# EAGLE design Oscilloscope (EAGLE 9.0.1)
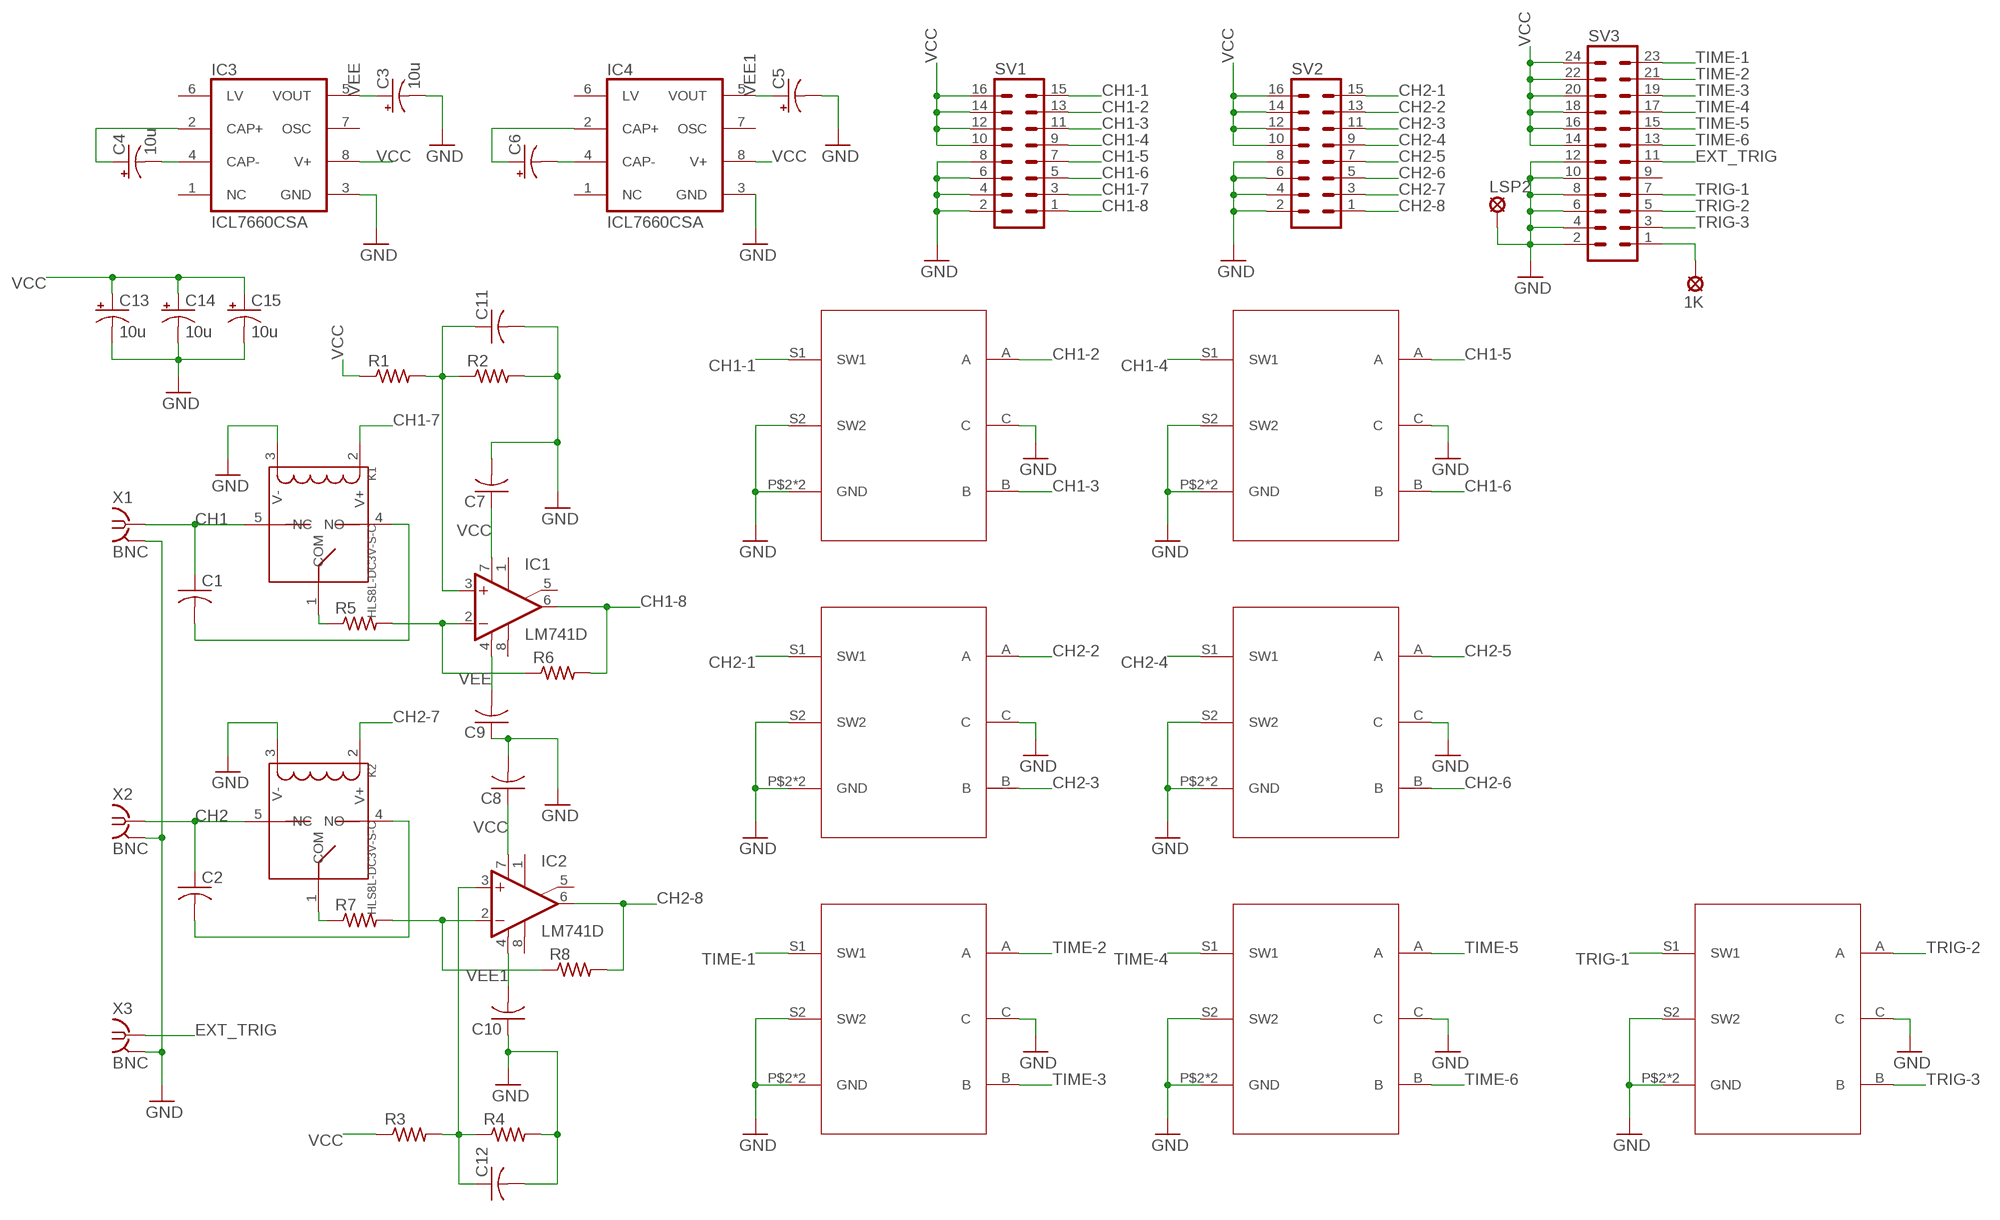
[diagram p0: schematic, sheet 1]

## Parts
1K  LSP11  [LSP11]
C1  C-USC0402K  [C0402K]
C2  C-USC0402  [C0402]
C3  10u  CPOL-USE2-5  [E2-5]
C4  10u  CPOL-USE2-5  [E2-5]
C5  CPOL-USE2-5  [E2-5]
C6  CPOL-USE2-5  [E2-5]
C7  C-USC0402  [C0402]
C8  C-USC0402  [C0402]
C9  C-USC0402  [C0402]
C10  C-USC0402  [C0402]
C11  C-USC0402  [C0402]
C12  C-USC0402K  [C0402K]
C13  10u  CPOL-USE2-5  [E2-5]
C14  10u  CPOL-USE2-5  [E2-5]
C15  10u  CPOL-USE2-5  [E2-5]
IC1  LM741D  [SO08]
IC2  LM741D  [SO08]
IC3  ICL7660CSA  [SO08]
IC4  ICL7660CSA  [SO08]
K1  HLS8L-DC3V-S-C  RELAY-HLS8L-DC3V-S-C(5P-19X15MM)  [REY5-19.0X15.0X15.0MM]
K2  HLS8L-DC3V-S-C  RELAY-HLS8L-DC3V-S-C(5P-19X15MM)  [REY5-19.0X15.0X15.0MM]
LSP2  LSP11  [LSP11]
R1  R-US_R0402  [R0402]
R2  R-US_R0402  [R0402]
R3  R-US_R0402  [R0402]
R4  R-US_R0402  [R0402]
R5  R-US_R0402  [R0402]
R6  R-US_R0402  [R0402]
R7  R-US_R0402  [R0402]
R8  R-US_R0402  [R0402]
SV1  MA08-2  [MA08-2]
SV2  MA08-2  [MA08-2]
SV3  MA12-2  [MA12-2]
U$2  EC11S  [EC11S]
U$3  EC11S  [EC11S]
U$4  EC11S  [EC11S]
U$5  EC11S  [EC11S]
U$6  EC11S  [EC11S]
U$7  EC11S  [EC11S]
U$8  EC11S  [EC11S]
X1  BNC  [BNC]
X2  BNC  [BNC]
X3  BNC  [BNC]

## Nets
CH1: C1.1 K1.5(NC) X1.P$1(SIG)
CH1-1: SV1.15 U$3.S1(SW1)
CH1-2: SV1.13 U$3.A
CH1-3: SV1.11 U$3.B
CH1-4: SV1.9 U$4.S1(SW1)
CH1-5: SV1.7 U$4.A
CH1-6: SV1.5 U$4.B
CH1-7: K1.2(V+) SV1.3
CH1-8: IC1.6(OUT) R6.2 SV1.1
CH2: C2.1 K2.5(NC) X2.P$1(SIG)
CH2-1: SV2.15 U$2.S1(SW1)
CH2-2: SV2.13 U$2.A
CH2-3: SV2.11 U$2.B
CH2-4: SV2.9 U$5.S1(SW1)
CH2-5: SV2.7 U$5.A
CH2-6: SV2.5 U$5.B
CH2-7: K2.2(V+) SV2.3
CH2-8: IC2.6(OUT) R8.2 SV2.1
EXT_TRIG: SV3.11 X3.P$1(SIG)
GND: C3.- C5.- C7.2 C8.2 C9.1 C10.1 C11.2 C12.2 C13.- C14.- C15.- IC3.3(GND) IC4.3(GND) K1.3(V-) K2.3(V-) LSP2.MP R2.2 R4.2 SV1.2 SV1.4 SV1.6 SV1.8 SV2.2 SV2.4 SV2.6 SV2.8 SV3.2 SV3.4 SV3.6 SV3.8 SV3.10 SV3.12 U$2.C U$2.P$2(GND) U$2.P$3(GND) U$2.S2(SW2) U$3.C U$3.P$2(GND) U$3.P$3(GND) U$3.S2(SW2) U$4.C U$4.P$2(GND) U$4.P$3(GND) U$4.S2(SW2) U$5.C U$5.P$2(GND) U$5.P$3(GND) U$5.S2(SW2) U$6.C U$6.P$2(GND) U$6.P$3(GND) U$6.S2(SW2) U$7.C U$7.P$2(GND) U$7.P$3(GND) U$7.S2(SW2) U$8.C U$8.P$2(GND) U$8.P$3(GND) U$8.S2(SW2) X1.P$2(GND) X1.P$3(GND) X1.P$4(GND) X1.P$5(GND) X2.P$2(GND) X2.P$3(GND) X2.P$4(GND) X2.P$5(GND) X3.P$2(GND) X3.P$3(GND) X3.P$4(GND) X3.P$5(GND)
N$1: C1.2 K1.4(NO)
N$2: C2.2 K2.4(NO)
N$4: IC2.2(-IN) R7.2 R8.1
N$5: C4.- IC3.4(CAP-)
N$6: C4.+ IC3.2(CAP+)
N$7: C6.- IC4.4(CAP-)
N$8: C6.+ IC4.2(CAP+)
N$9: C11.1 IC1.3(+IN) R1.2 R2.1
N$10: C12.1 IC2.3(+IN) R3.2 R4.1
N$11: 1K.MP SV3.1
N$19: K1.1(COM) R5.1
N$20: IC1.2(-IN) R5.2 R6.1
N$21: K2.1(COM) R7.1
TIME-1: SV3.23 U$6.S1(SW1)
TIME-2: SV3.21 U$6.A
TIME-3: SV3.19 U$6.B
TIME-4: SV3.17 U$7.S1(SW1)
TIME-5: SV3.15 U$7.A
TIME-6: SV3.13 U$7.B
TRIG-1: SV3.7 U$8.S1(SW1)
TRIG-2: SV3.5 U$8.A
TRIG-3: SV3.3 U$8.B
VCC: C7.1 C8.1 C13.+ C14.+ C15.+ IC1.7(V+) IC2.7(V+) IC3.8(V+) IC4.8(V+) R1.1 R3.1 SV1.10 SV1.12 SV1.14 SV1.16 SV2.10 SV2.12 SV2.14 SV2.16 SV3.14 SV3.16 SV3.18 SV3.20 SV3.22 SV3.24
VEE: C3.+ C9.2 IC1.4(V-) IC3.5(VOUT)
VEE1: C5.+ C10.2 IC2.4(V-) IC4.5(VOUT)
Unconnected: IC1.1(ON1) IC1.5(ON2) IC1.8(OPT) IC2.1(ON1) IC2.5(ON2) IC2.8(OPT) IC3.1(NC) IC3.6(LV) IC3.7(OSC) IC4.1(NC) IC4.6(LV) IC4.7(OSC) SV3.9

## Library data of the parts
1K LSP2 = solpad:LSP11: SOLDER PAD drill 1.1 mm
C1 C2 C7-C12 = rcl:C-US: CAPACITOR, American symbol; SPICEPREFIX: C
C3-C6 C13-C15 = rcl:CPOL-US: POLARIZED CAPACITOR, American symbol; SPICEPREFIX: C
IC1 IC2 = linear:*741: OP AMP
IC3 IC4 = maxim:ICL7660CSA: VOLTAGE CONVERTER; MF: MAXIM; MPN: ICL7660CSA; OC_FARNELL: 9724710; OC_NEWARK: 34C3732
K1 K2 = Seeed-Relay:RELAY-HLS8L-DC3V-S-C(5P-19X15MM): 315030009; MPN: HLS8L-DC3V-S-C
R1-R8 = resistor:R-US_: RESISTOR, American symbol
SV1 SV2 = con-lstb:MA08-2: PIN HEADER; OC_FARNELL: unknown; OC_NEWARK: unknown
SV3 = con-lstb:MA12-2: PIN HEADER; OC_FARNELL: unknown; OC_NEWARK: unknown
U$2-U$8 = MAX6818:EC11S
X1-X3 = MAX6818:BNC

## Board
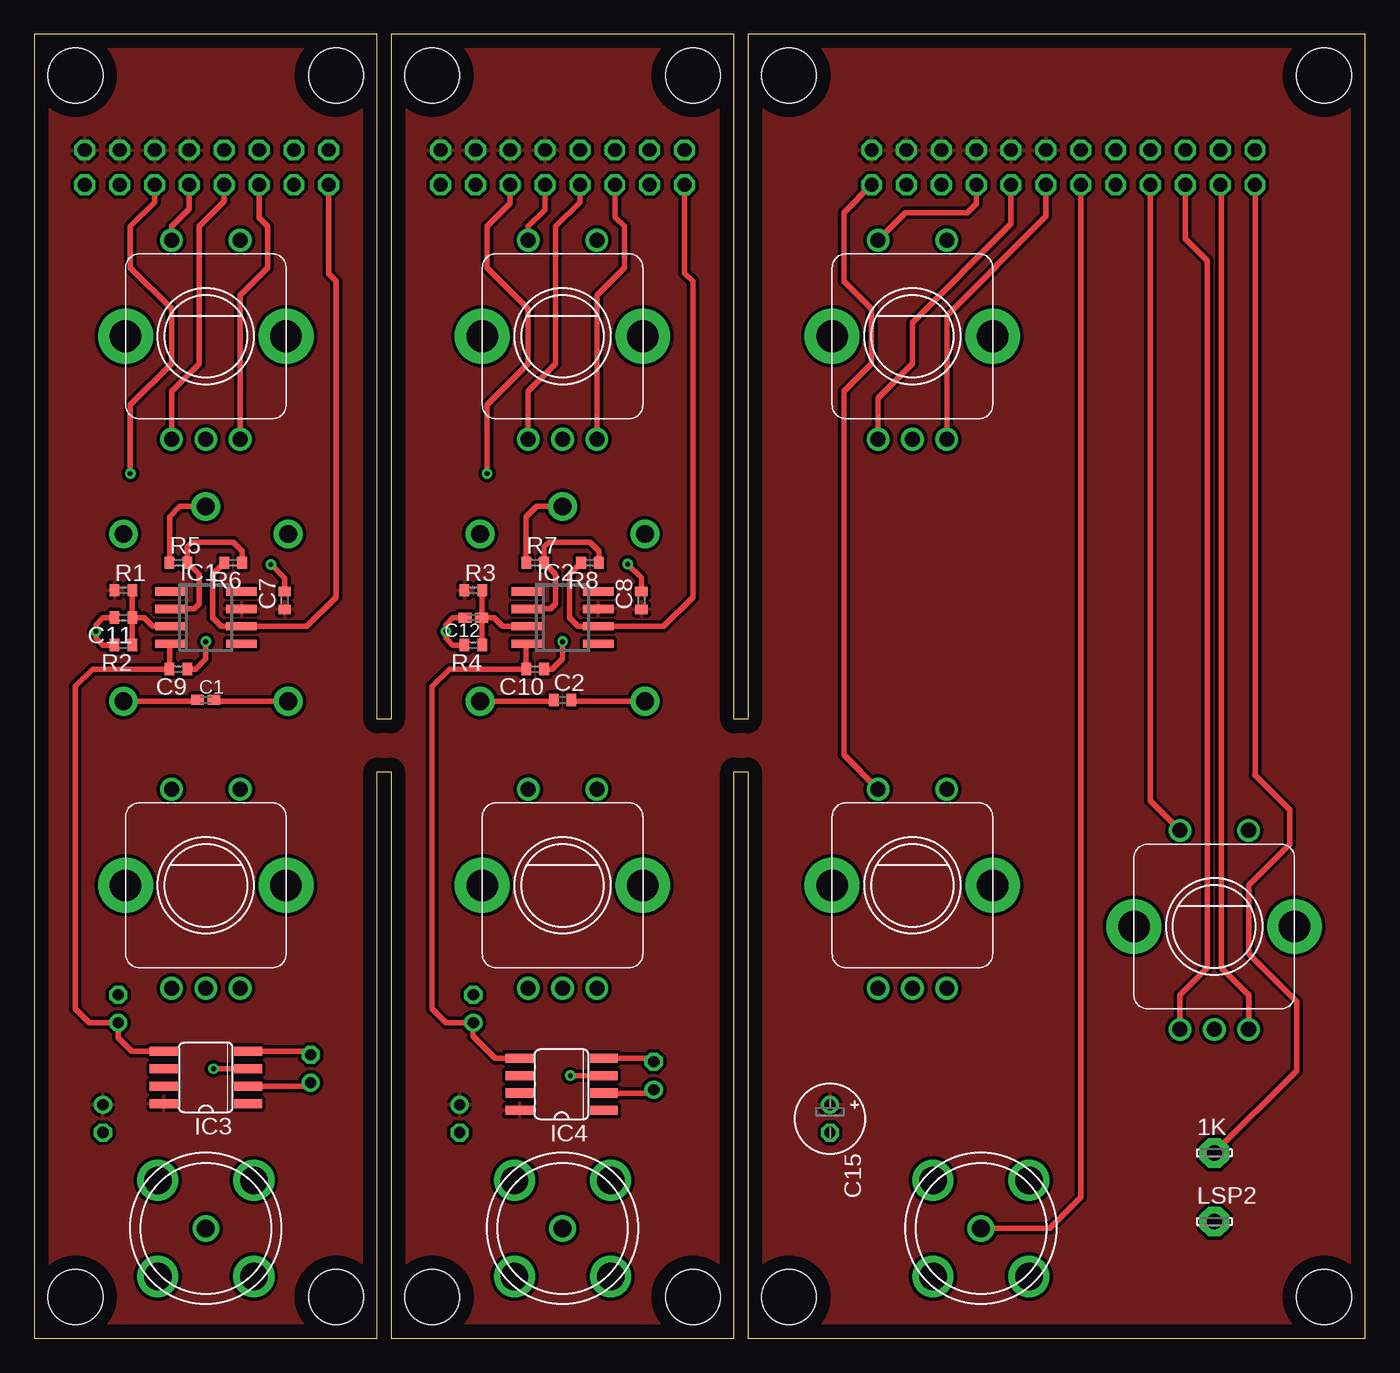
[diagram p1: board, top side]
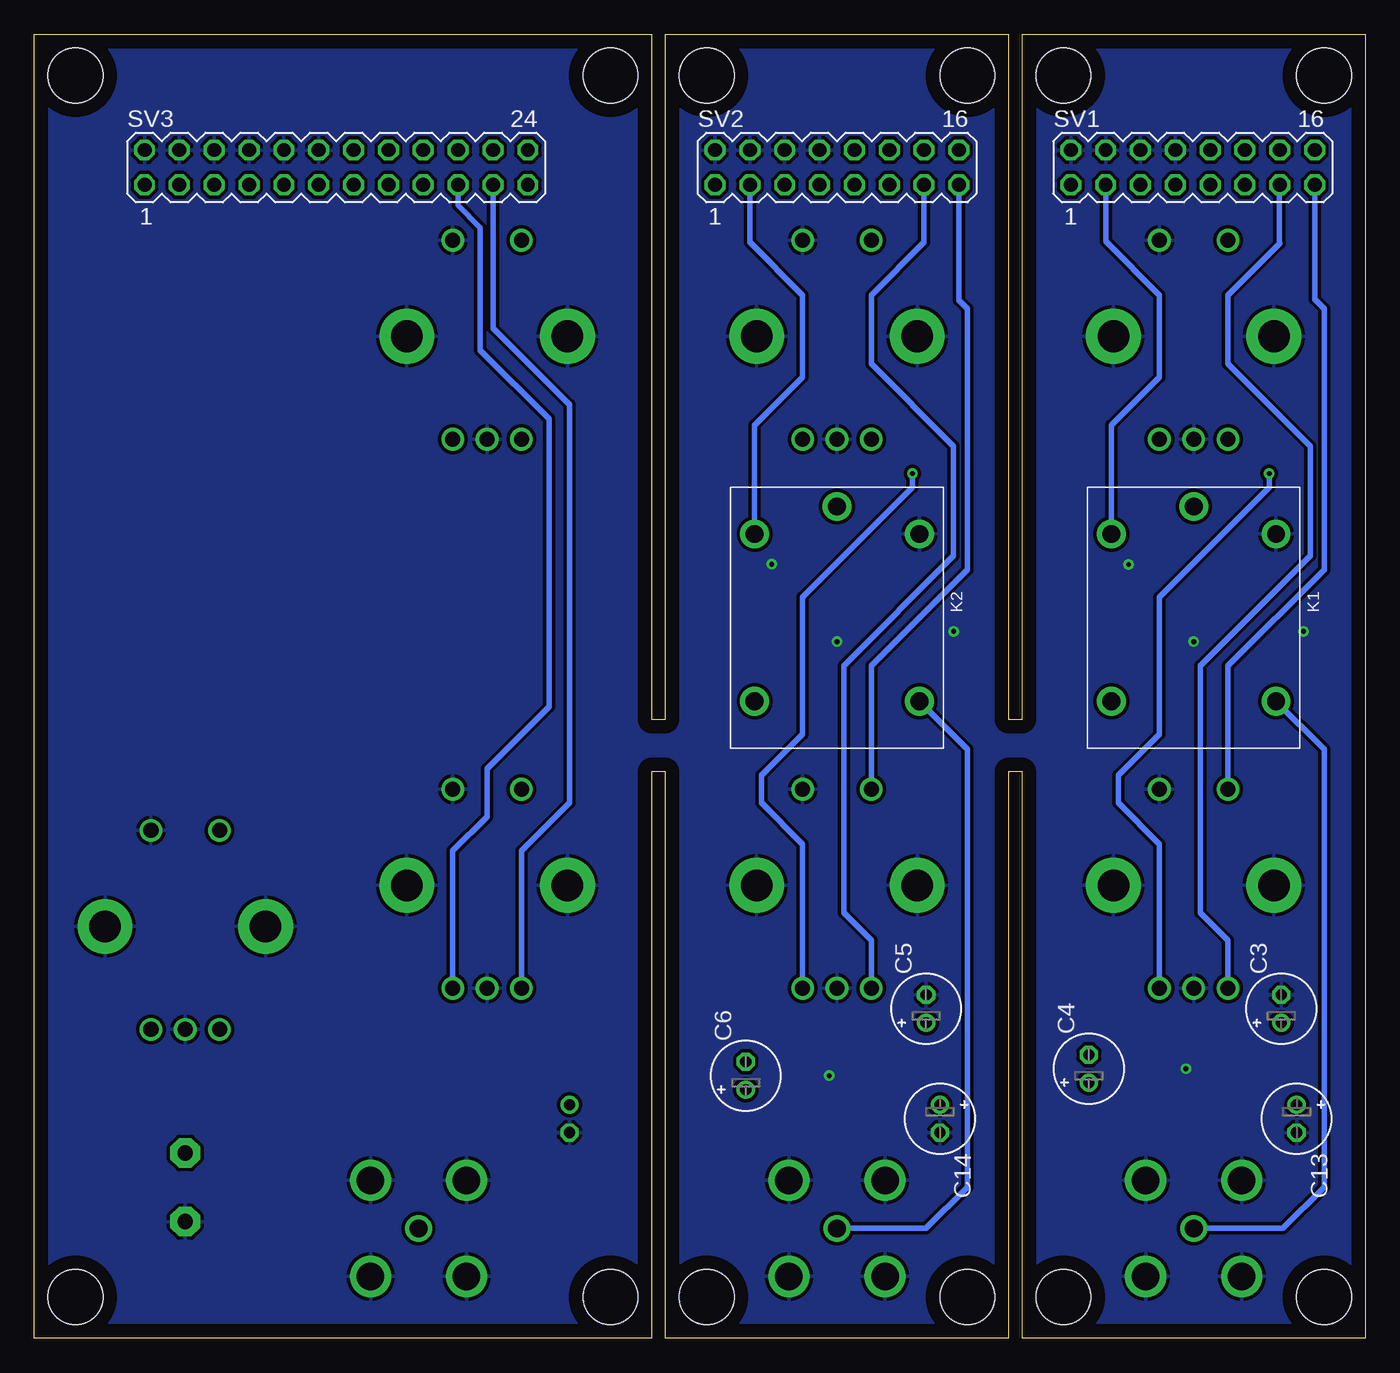
[diagram p2: board, bottom side, seen from below]

Size 97 x 95 mm. Coordinates in mm from the lower left corner, seen from the top.
Outline: 0,0 25,0 25,41.27 26,41.27 26,0 51,0 51,41.27 52,41.27 52,0 97,0 97,95 52,95 52,45.09 51,45.09 51,95 26,95 26,45.09 25,45.09 25,95 0,95 0,0
Copper layers (1*16): Top 0.035mm / dielectric 1.5mm / Bottom 0.035mm
Design rules "default": minimum track width 6mil, minimum drill 0.35mm, track to track 6mil, track to pad 6mil, pad to pad 6mil, via to via 6mil, smd to smd 6mil, copper to edge 40mil, drill to drill 6mil, minimum pad ring 10mil, minimum via ring 8mil, stop-mask expansion 4mil, vias tented up to drill 0mil, thermal gap 10mil
Holes 4 mm at 3,3 29,3 22,3 48,3 55,3 94,3 55,92 94,92 48,92 29,92 22,92 3,92

### Footprints (pad centres in the part's own frame; a part is rotated, then mirrored left to right if it is on the bottom)
LSP11 = drill 1.118 pad 2.159 octagon: MP 0,0
C0402K = smd 0.925 x 0.74: 1 -0.6,0; 2 0.6,0
C0402 = smd 0.7 x 0.9: 1 -0.65,0; 2 0.65,0
E2-5 = drill 0.813 pad 1.27: + -1.016,0 | drill 0.813 pad 1.27 octagon: - 1.016,0
SO08 = smd 0.6 x 2.2: 1 -1.905,-2.6; 2 -0.635,-2.6; 3 0.635,-2.6; 4 1.905,-2.6; 5 1.905,2.6; 6 0.635,2.6; 7 -0.635,2.6; 8 -1.905,2.6
SO08' = smd 0.66 x 2.032: 1 -1.905,-3.073; 2 -0.635,-3.073; 3 0.635,-3.073; 4 1.905,-3.073; 5 1.905,3.073; 6 0.635,3.073; 7 -0.635,3.073; 8 -1.905,3.073
REY5-19.0X15.0X15.0MM = drill 1.3 pad 2.1: 1 -8.1,0; 2 -6.1,-6; 3 -6.1,6; 4 6.1,-6; 5 6.1,6
R0402 = smd 0.7 x 0.9: 1 -0.65,0; 2 0.65,0
MA08-2 = drill 1.016 octagon: 1 -8.89,-1.27; 2 -8.89,1.27; 3 -6.35,-1.27; 4 -6.35,1.27; 5 -3.81,-1.27; 6 -3.81,1.27; 7 -1.27,-1.27; 8 -1.27,1.27; 9 1.27,-1.27; 10 1.27,1.27; 11 3.81,-1.27; 12 3.81,1.27; 13 6.35,-1.27; 14 6.35,1.27; 15 8.89,-1.27; 16 8.89,1.27
MA12-2 = drill 1.016 octagon: 1 -13.97,-1.27; 2 -13.97,1.27; 3 -11.43,-1.27; 4 -11.43,1.27; 5 -8.89,-1.27; 6 -8.89,1.27; 7 -6.35,-1.27; 8 -6.35,1.27; 9 -3.81,-1.27; 10 -3.81,1.27; 11 -1.27,-1.27; 12 -1.27,1.27; 13 1.27,-1.27; 14 1.27,1.27; 15 3.81,-1.27; 16 3.81,1.27; 17 6.35,-1.27; 18 6.35,1.27; 19 8.89,-1.27; 20 8.89,1.27; 21 11.43,-1.27; 22 11.43,1.27; 23 13.97,-1.27; 24 13.97,1.27
EC11S = drill 1.1: A -2.5,-7.5; B 2.5,-7.5; C 0,-7.5; S1 -2.5,7; S2 2.5,7 | drill 2.3 pad 4: P$2 -5.85,0; P$3 5.85,0
BNC = drill 1.3: P$1 0,0 | drill 2: P$2 3.5,3.5; P$3 -3.5,3.5; P$4 3.5,-3.5; P$5 -3.5,-3.5

### Placement (x,y rotation side)
1K  86,13.5 0 top
C1  12.5,46.51 0 top
C2  38.5,46.5 0 top
C3  6.12,24 90 bottom
C4  20.14,19.64 90 bottom
C5  32,24 90 bottom
C6  45.15,19.13 90 bottom
C7  18.25,53.75 90 top
C8  44.25,53.75 90 top
C9  10.5,48.75 180 top
C10  36.5,48.75 180 top
C11  6.5,52.5 180 top
C12  32,52.5 180 top
C13  5,16 270 bottom
C14  31,16 270 bottom
C15  58,16 270 top
IC1  12.5,52.5 270 top
IC2  38.5,52.5 270 top
IC3  ICL7660CSA  [SO08']  12.5,19 90 top
IC4  ICL7660CSA  [SO08']  38.43,18.5 90 top
K1  12.5,52.5 270 bottom
K2  38.5,52.5 270 bottom
LSP2  86,8.5 0 top
R1  6.5,54.5 0 top
R2  6.5,50.5 180 top
R3  32,54.5 0 top
R4  32,50.5 180 top
R5  10.5,56.5 0 top
R6  14.5,56.5 180 top
R7  36.5,56.5 0 top
R8  40.5,56.5 180 top
SV1  12.57,85.3 0 bottom
SV2  38.5,85.3 0 bottom
SV3  75,85.3 0 bottom
U$2  38.5,33 0 top
U$3  12.5,33 0 top
U$4  12.5,73 0 top
U$5  38.5,73 0 top
U$6  64,33 0 top
U$7  64,73 0 top
U$8  86,30 0 top
X1  12.5,8 0 top
X2  38.5,8 0 top
X3  69,8 0 top

### Tracks (layer width: path | path; a pad name or v marks a point on that pad's centre or on a via)
CH1
  Top 0.406: C1.1 11.79,46.4 K1.5
  Bottom 0.406: X1.P$1 6,8 3,11 3,42.9 K1.5
CH1-1
  Bottom 0.406: U$3.S1 10,49 3,56 3,75 3.68,75.68 SV1.15
CH1-2
  Bottom 0.406: 6.25,79.75 10,76 10,71 4,65 4,57 12,49 12,31 10,29 U$3.A | 6.25,79.75 6.22,79.78 | 6.25,79.75 6.25,84 SV1.13
CH1-3  (via drill 0.35)
  Top 0.406: v7,63 7,68 10,71 10,75 7,78 7,81 8.76,82.76 SV1.11
  Bottom 0.406: v7,63 7,62 15,54 15,44 18,41 18,39 15,36 U$3.B
CH1-4
  Top 0.406: U$4.S1 10,81 11.3,82.3 SV1.9
CH1-5
  Top 0.406: U$4.A 10,69 12,71 12,81 13.84,82.84 SV1.7
CH1-6
  Top 0.406: U$4.B 15,76 17,78 17,81 16.38,81.62 SV1.5
CH1-7
  Bottom 0.406: K1.2 18.5,66.5 15,70 15,76 18.92,79.92 SV1.3
CH1-8
  Top 0.406: R6.2 13,55.65 13,52.5 13.63,51.87 IC1.6 19.86,51.87 22,54 22,77 21.46,77.54 SV1.1
CH2
  Top 0.406: K2.5 37.75,46.4 C2.1
  Bottom 0.406: X2.P$1 32,8 29,11 29,42.9 K2.5
CH2-1
  Bottom 0.406: U$2.S1 36,49 29,56 29,75 29.61,75.61 SV2.15
CH2-2
  Bottom 0.406: U$2.A 36,29 38,31 38,49 30,57 30,65 36,71 36,76 32.15,79.85 SV2.13
CH2-3  (via drill 0.35)
  Top 0.406: v33,63 33,68 36,71 36,75 33,78 33,81 34.69,82.69 SV2.11
  Bottom 0.406: v33,63 33,62 41,54 41,44 44,41 44,39 41,36 U$2.B
CH2-4
  Top 0.406: U$5.S1 36,81 37.23,82.23 SV2.9
CH2-5
  Top 0.406: U$5.A 36,69 38,71 38,81 39.77,82.77 SV2.7
CH2-6
  Top 0.406: U$5.B 41,76 43,78 43,81 42.31,81.69 SV2.5
CH2-7
  Bottom 0.406: K2.2 44.5,66.5 41,70 41,76 44.85,79.85 SV2.3
CH2-8
  Top 0.406: R8.2 39,55.65 39,52.5 39.63,51.87 IC2.6 45.87,51.87 48,54 48,77 47.39,77.61 SV2.1
EXT_TRIG
  Top 0.406: SV3.11 76.27,10.27 74,8 X3.P$1
GND  (via drill 0.35)
  Top 0.406: IC3.3 v13.07,19.64 v13.06,19.64 | IC4.3 v39.07,19.14 v39.06,19.13 | C11.2 5,52.5 4.5,52 v4.5,51.5 4.5,51 5,50.5 R2.2 | C9.1 11.75,48.75 12.5,49.5 v12.5,50.75 | C10.1 37.75,48.75 38.5,49.5 v38.5,50.75 | C12.2 30.5,52.5 30,52 v30,51.5 30,51 30.5,50.5 R4.2 | C7.2 18.25,55.38 v17.25,56.38 | C8.2 44.25,55.4 v43.25,56.4
  pour Bottom (isolate 0.254): -6.91,98 105.64,98 105.64,-6.91 -6.91,-6.91
N$1
  Top 0.406: C1.2 13.21,46.4 K1.4
N$2
  Top 0.406: K2.4 39.25,46.4 C2.2
N$4
  Top 0.406: IC2.2 37.63,53.13 38,53.5 38,55.65 R7.2 37.15,57.65 37.5,58 40.5,58 41.15,57.35 R8.1
N$5
  Top 0.406: IC3.4 19.89,20.91 C4.-
N$6
  Top 0.406: IC3.2 19.89,18.36 C4.+
N$7
  Top 0.406: IC4.4 44.88,20.41 C6.-
N$8
  Top 0.406: IC4.2 44.9,17.86 C6.+
N$9
  Top 0.406: R2.1 C11.1 | C11.1 R1.2 | IC1.3 8.63,51.87 8,52.5 C11.1
N$10
  Top 0.406: R3.2 32.65,52.55 | 32.65,52.55 C12.1 33.5,52.5 34.13,51.87 IC2.3 | R4.1 32.65,52.55
N$11
  Top 0.406: 88.97,41.03 89,41 | 89,41 91.5,38.5 91.5,36 88.5,33 88.5,28 92,24.5 92,19.5 1K.MP | SV3.1 89,84 89,41
N$19
  Top 0.406: R5.1 9.85,59.85 10.6,60.6 K1.1
N$20
  Top 0.406: IC1.2 11.63,53.13 12,53.5 12,55.65 R5.2 11.15,57.65 11.5,58 14.5,58 15.15,57.35 R6.1
N$21
  Top 0.406: R7.1 35.85,59.85 36.6,60.6 K2.1
TIME-1
  Top 0.406: U$6.S1 59,42.5 59,69 61,71 61,75 59,77 59,82 SV3.23
TIME-2
  Bottom 0.406: U$6.A 61.5,35.5 58,39 58,68 63.57,73.57 SV3.21
TIME-3
  Bottom 0.406: U$6.B 66.5,35.5 64,38 64,41.5 59.5,46 59.5,67 64.5,72 64.5,80.92 66.11,82.53 SV3.19
TIME-4
  Top 0.406: U$7.S1 63.5,82 68,82 68.65,82.65 SV3.17
TIME-5
  Top 0.406: U$7.A 61.5,68.5 64,71 64,74 71.19,81.19 SV3.15
TIME-6
  Top 0.406: U$7.B 66.5,74.5 73.73,81.73 SV3.13
TRIG-1
  Top 0.406: U$8.S1 81.35,39.15 SV3.7
TRIG-2
  Top 0.406: U$8.A 83.5,25 85.5,27 85.5,78.5 83.89,80.11 SV3.5
TRIG-3
  Top 0.406: U$8.B 88.5,25 86.5,27 86.5,83.96 SV3.3
VCC
  pour Top (isolate 0.254): -2.54,100.36 99.06,100.36 99.06,-2.54 -3.54,-2.54
VEE
  Top 0.406: IC1.4 9.85,50.53 C9.2 4.25,48.75 3,47.5 3,24 4.02,22.98 C3.+ 6.12,21.88 7.09,20.91 IC3.5
VEE1
  Top 0.406: IC2.4 35.85,50.55 C10.2 30.25,48.75 29,47.5 29,24 30,23 31.98,23 31.99,22.99 | C5.+ 31.99,22.99 | IC4.5 33.59,20.41 31.99,22.01 31.99,22.99